# Altium schematic sheet TPS75501_3V3.SchDoc: PSU TPS75501 3V3
size A4; Organization: Altium Limited.; Address1: Level 3, 12a Rodborough Rd; Address2: Frenchs Forest 2086; Address3: NSW; Address4: AUSTRALIA; Revision: 6; SheetNumber: 32; SheetTotal: 64
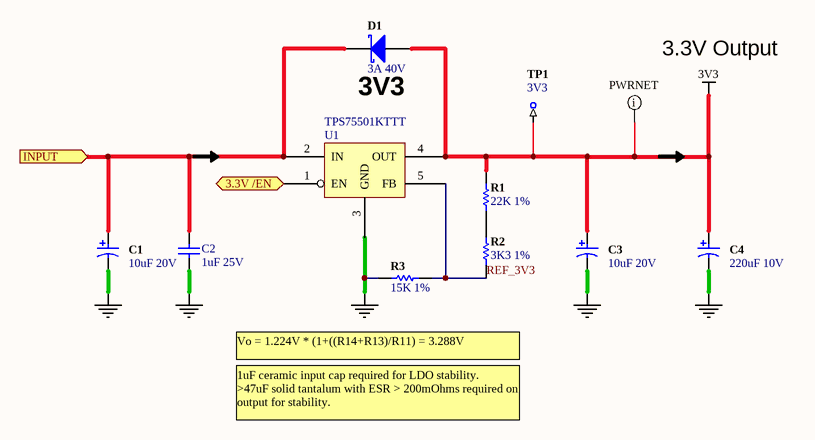
[diagram p0: TPS75501_3V3.SchDoc]

## Parts
C1  10uF 20V  [CAPC3528-STAR]
C2  1uF 25V  [CAPC3216-STAR]
C3  10uF 20V  [CAPC3528-STAR]
C4  220uF 10V  [CAPC7343-STAR]
D1  3A 40V  [DIOM5027]
R1  22K 1%  [RESC1005-STAR]
R2  3K3 1%  [RESC1005-STAR]
R3  15K 1%  [RESC1005-STAR]
TP1  3V3  [TestPin]  (no BOM)
U1  TPS75501KTTT  [TO-263]

## Ports
3.3V /EN, INPUT (in)

## Nets
3V3: C3.1 C4.1 D1.1(A) R1.2 TP1.1 U1.4(OUT)
GND: C1.2 C2.2 C3.2 C4.2 R3.1 U1.3(GND)
3.3V /EN: U1.1(EN) ; port 3.3V /EN
INPUT: C1.1 C2.1 D1.2(K) U1.2(IN) ; port INPUT
REF_3V3: R2.1 R3.2 U1.5(FB)
NetR1_1: R1.1 R2.2

## Layout directives
net class PWRNET: 3V3

## Notes on the sheet
- (near D1) 3V3
- 3.3V Output
- Vo = 1.224V * (1+((R14+R13)/R11) = 3.288V
- 1uF ceramic input cap required for LDO stability.
  >47uF solid tantalum with ESR > 200mOhms required on output for stability.
- Sheet Title
- Project Title
- Size:
- Date:
- A4
- Assy:
- Time:
- Sheet
- Revision:
- of
- File:

## Library data of the parts
C1 C3 = D-101-0007: Capacitor, Tantalum, 10uF 10% 20V MCCT-B (3528); Polarity: Polarized; Category: Capacitor; Capacitance: 10 uF; Mounting Technology: Surface Mount; Rated Voltage: 20 V; Status: Production; Technology: Tantalum; Tolerance: 10 %
C2 = D-101-0027: Capacitor, Ceramic, 1uF 10% 25V 1206 (3216) X7R; Polarity: Non-Polarized; Capacitance: 1 uF; Dielectric: X7R; Mounting Technology: Surface Mount; Rated Voltage: 25 V; Status: Production; Technology: Ceramic; Tolerance: 10 %; Category: Capacitor
C4 = D-101-0088: Capacitor, Tantalum, 220uF 10% 10V MCCT-D (7343-31); Polarity: Polarized; Category: Capacitor; Capacitance: 220 uF; Mounting Technology: Surface Mount; Rated Voltage: 10 V; Status: Unreleased; Technology: Tantalum; Tolerance: 10 %
D1 = D-151-0000: Schottky Diode, 3A 40V; Category: Diode-Schottky; Status: Production
R1 = D-100-0114: Resistor, 22K 1% 0402 (1005); Power Rating: mW; Category: Resistor; Mounting Technology: Surface Mount; Resistance: 22 K; Status: Production; Tolerance: 1 %
R2 = D-100-0098: Resistor, 3K3 1% 0402 (1005); Power Rating: 63 mW; Resistance: 3.3 K; Category: Resistor; Mounting Technology: Surface Mount; Status: Production; Tolerance: 1 %
R3 = D-100-0125: Resistor, 15K 1% 0402 (1005); Power Rating: 63 mW; Category: Resistor; Mounting Technology: Surface Mount; Resistance: 15 K; Status: Production; Tolerance: 1 %
TP1 = D-006-0000: Test Point, PCB Mount with Silkscreen Box; Category: Test-Point; Status: Production
U1 = D-204-0014: TPS75501KTTT, 5A, Low Dropout, Adjustable, Linear Voltage Regulator, TO-263; Max Input Voltage: 6 V; Max Output Voltage: 5.5 V; Min Input Voltage: 1 V; Supply Voltage: mV; Max Output Current: 5 A; Min Output Voltage: 1 V; Mounting Technology: Surface Mount; Status: Production; Temperature Range: -40 to +125; Category: IC-Power